# Altium project task_86.PrjPcb
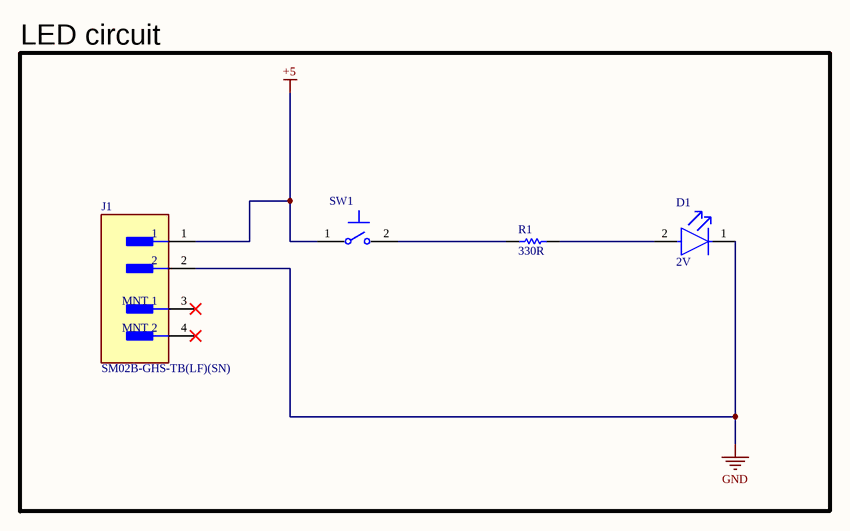
[diagram p0: Sheet86.SchDoc]
1 sheet, 4 parts. Net scope: global (net labels, ports and power ports of the same name join across sheets).
Board file: PCB-LED.PcbDoc

## Sheet Sheet86.SchDoc
size A; SheetNumber: 1; SheetTotal: 1

### Parts
D1  2V  [FP-LTST-C190GKT-MFG]
J1  SM02B-GHS-TB(LF)(SN)  [FP-SM02B-GHS-TB_LF_SN-MFG]
R1  330R  [RESC1608X55X25NL10T15]
SW1  (no value)  [FP-TL1015AF160QG-MFG]

### Blocks framed on the sheet
LED circuit: D1 J1 R1 SW1

### Nets
+5: J1.1 SW1.1
GND: D1.1(C) J1.2
NetD1_2: D1.2(A) R1.2
NetR1_1: R1.1 SW1.2

Not connected (* = marked no-connect by the designer): J1 3(MNT_1)* 4(MNT_2)*

### Library data of the parts
D1 = CMP-22017-000005-2: LED GREEN CLEAR CHIP SMD; Dominant Wavelength: 569nm; Reverse Voltage: 5V; Lens Color: Colorless; Viewing Angle: 130°; Forward Current: 30mA; Power Dissipation: 100mW; Luminous Intensity: 6mcd; Number of LEDs: 1; Forward Voltage: 2.1V; Wavelength: 565nm; Test Current: 10mA; Min Operating Temperature: -55°C; Lens Style: Clear; Mount: Surface Mount; Width: 0.8mm; Packaging: Tape and Reel; Voltage: 2V; Lens Transparency: Clear; Case Code (Metric): 1608; Depth: 0.8mm; Case Code (Imperial): 0603; Case/Package: 0603; Number of Pins: 2; Max Operating Temperature: 85°C; Lead Free: Lead Free; Number of Elements: 1; Length: 1.6mm; Height: 0.8mm; Package Quantity: 1; Power Rating: 100mW; Radiation Hardening: No; Illumination Color: Green; Color: Green
J1 = CMP-2000-07076-2: CONN HEADER SMD R/A 2POS 1.25MM; Voltage Rating: 50V; Number of Positions: 2; Pitch: 0.049inch; Current Rating: 1A; Connector Type: Outer Shroud Contact; Number of Rows: 1; Contact Material: Bronze; Termination: Solder; Color: Natural; Package Quantity: 2500; Mount: Surface Mount; Housing Color: Natural; Number of Contacts: 2; Packaging: Tape and Reel; Lead Free: Lead Free; Housing Material: Nylon; Orientation: Right Angle; Contact Type: Male Pin; Contact Plating: Tin; Series: GH; Fastening Type: Latch
R1 = CMP-1659-00020-2: Chip Resistor, 330 Ohm, +/- 1%, 0.1 W, -55 to 155 degC, 0603 (1608 Metric), RoHS, Tape and Reel; Tolerance: 10%; ESR: 800 mohm; Voltage Rating (DC): 16 V; Capacitance: 47 uF; Length: 7.3 mm; ComponentLink1URL: http://www.yageo.com/; Packaging: Tape and Reel; Pins: 2; ComponentLink1Description: Manufacturer URL; Case Code (Imperial): 2917; REACH SVHC: No SVHC; Width: 4.3 mm; ComponentLink2Description: Datasheet; Voltage Rating: 16 V; RoHSCompliant: True; Max Operating Temperature: 125degC; ComponentLink2URL: http://www.yageo.com/documents/recent/PYu-RC_Group_51_RoHS_L_04.pdf; Min Operating Temperature: -55degC; Case/Package: 2917; Radiation Hardening: No; DatasheetVersion: Rev. 4, 02/2016; Mount: Surface Mount; PackageReference: 0603; Package Quantity: 500; Case Code (Metric): 7343; PackageDescription: 2-Pin Surface Mount Device, Body 1.6 x 0.8 mm; Height: 3.1 mm
SW1 = CMP-17879-000003-1: SWITCH TACTILE SPST-NO 0.05A 12V; Actuator Type: Standard; Actuator Length: 0.5mm; Contact Current Rating: 50mA; Mechanical Life: 200000Cycles; Switch Function: Off-Mom; Switch Travel: 0.2mm; Illumination Type: Non-Illuminated; Operating Force: 160gf; Actuator Material: Nylon; Electrical Life: 50000Cycles; Throw Configuration: SPST; Contact Resistance: 100mR; Orientation: Straight; Max Voltage Rating (DC): 12V; Max Operating Temperature: 70°C; Package Quantity: 1; Contact Material: Silver; Packaging: Tape and Reel; Mount: Surface Mount; Color: Beige; Termination: Gull Wing; Case/Package: SMD/SMT; Voltage Rating (DC): 12V; Contact Plating: Silver; REACH SVHC: No SVHC; Min Operating Temperature: -20°C; Current Rating: 50mA; Lead Free: Lead Free